# Altium project Pathfinder.PrjPcb
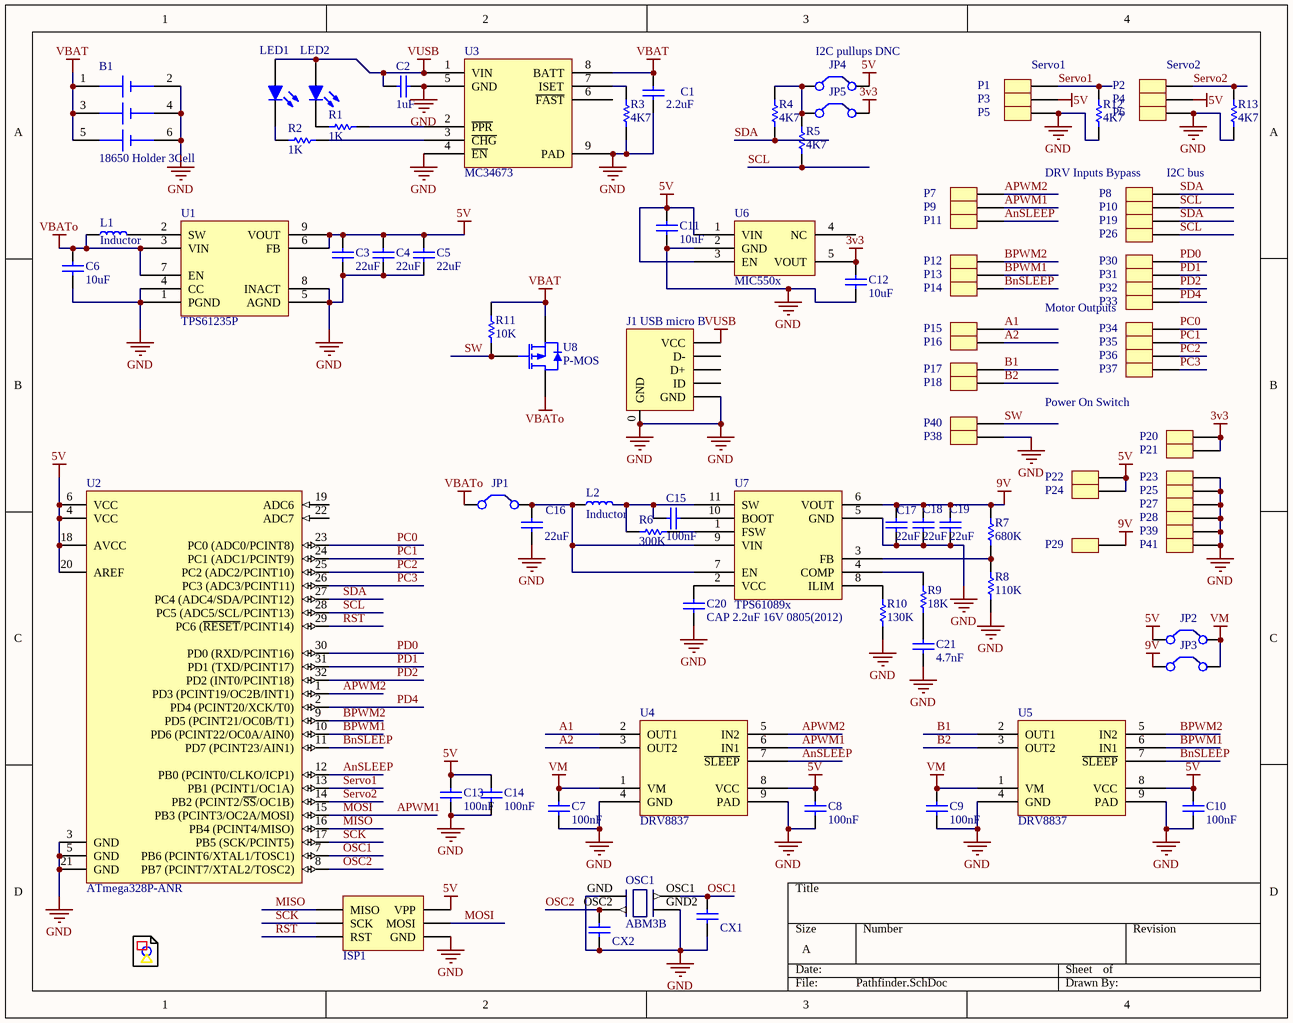
[diagram p0: Pathfinder.SchDoc]
1 sheet, 99 parts. Net scope: global (net labels, ports and power ports of the same name join across sheets).
Board file: Pathfinder.PcbDoc

## Sheet Pathfinder.SchDoc
size A

### Parts
*  Logo  [Zap Cloud]  (value not drawn)
B1  18650 Holder 3Cell  [18650-3Cell]
C1  2.2uF  [CAPC0805(2012)100_L]
C2  1uF  [CAPC0805(2012)100_L]
C3  22uF  [CAPC0805(2012)100_L]
C4  22uF  [CAPC0805(2012)100_L]
C5  22uF  [CAPC0805(2012)100_L]
C6  10uF  [CAPC0805(2012)145_M]
C7  100nF  [CAPC0805(2012)100_M]
C8  100nF  [CAPC0805(2012)100_M]
C9  100nF  [CAPC0805(2012)100_M]
C10  100nF  [CAPC0805(2012)100_M]
C11  10uF  [CAPC0805(2012)145_M]
C12  10uF  [CAPC0805(2012)145_M]
C13  100nF  [CAPC0805(2012)100_M]
C14  100nF  [CAPC0805(2012)100_M]
C15  100nF  [CAPC0805(2012)100_M]
C16  22uF  [CAPC0805(2012)100_L]
C17  22uF  [CAPC0805(2012)100_L]
C18  22uF  [CAPC0805(2012)100_L]
C19  22uF  [CAPC0805(2012)100_L]
C20  CAP 2.2uF 16V 0805(2012)  [CAPC0805(2012)145_L]
C21  4.7nF  [CAPC0805(2012)145_N]
CX1  CAP 22pF 10V 0603(1608)  [CAPC0603(1608)100_M]  (value not drawn)
CX2  CAP 22pF 10V 0603(1608)  [CAPC0603(1608)100_M]  (value not drawn)
ISP1  AVRISP  [2x3 100mil Header]  (value not drawn)
J1  USB micro B  [USB Micro SMD]
JP1  SolderJumper  [bridge]  (value not drawn)
JP2  SolderJumper  [bridge]  (value not drawn)
JP3  SolderJumper  [bridge]  (value not drawn)
JP4  SolderJumper  [bridge]  (value not drawn)
JP5  SolderJumper  [bridge]  (value not drawn)
L1  Inductor  [XAL7030-102ME]
L2  Inductor  [CDMC8D28NP-1R8MC]
LED1  LED2  [LED0805]  (value not drawn)
LED2  LED2  [LED0805]  (value not drawn)
OSC1  ABM3B  [ABM3B]
P1  SV1  [Pin 100mil]  (value not drawn)
P2  SV2  [Pin 100mil]  (value not drawn)
P3  5V  [Pin 100mil]  (value not drawn)
P4  5V  [Pin 100mil]  (value not drawn)
P5  GND  [Pin 100mil]  (value not drawn)
P6  GND  [Pin 100mil]  (value not drawn)
P7  Ain2  [Pin 100mil]  (value not drawn)
P8  SDA  [Pin 100mil]  (value not drawn)
P9  Ain1  [Pin 100mil]  (value not drawn)
P10  SCL  [Pin 100mil]  (value not drawn)
P11  ASLP  [Pin 100mil]  (value not drawn)
P12  Bin2  [Pin 100mil]  (value not drawn)
P13  Bin1  [Pin 100mil]  (value not drawn)
P14  BSLP  [Pin 100mil]  (value not drawn)
P15  AO1  [Pin 100mil]  (value not drawn)
P16  AO2  [Pin 100mil]  (value not drawn)
P17  BO1  [Pin 100mil]  (value not drawn)
P18  BO2  [Pin 100mil]  (value not drawn)
P19  SDA  [Pin 100mil]  (value not drawn)
P20  3v3  [Pin 100mil]  (value not drawn)
P21  3v3  [Pin 100mil]  (value not drawn)
P22  5V  [Pin 100mil]  (value not drawn)
P23  GND  [Pin 100mil]  (value not drawn)
P24  5V  [Pin 100mil]  (value not drawn)
P25  GND  [Pin 100mil]  (value not drawn)
P26  SCL  [Pin 100mil]  (value not drawn)
P27  GND  [Pin 100mil]  (value not drawn)
P28  GND  [Pin 100mil]  (value not drawn)
P29  9V  [Pin 100mil]  (value not drawn)
P30  PD0  [Pin 100mil]  (value not drawn)
P31  PD1  [Pin 100mil]  (value not drawn)
P32  PD2  [Pin 100mil]  (value not drawn)
P33  PD4  [Pin 100mil]  (value not drawn)
P34  PC0  [Pin 100mil]  (value not drawn)
P35  PC1  [Pin 100mil]  (value not drawn)
P36  PC2  [Pin 100mil]  (value not drawn)
P37  PC3  [Pin 100mil]  (value not drawn)
P38  SDA  [Pin 100mil]  (value not drawn)
P39  GND  [Pin 100mil]  (value not drawn)
P40  SDA  [Pin 100mil]  (value not drawn)
P41  GND  [Pin 100mil]  (value not drawn)
R1  1K  [RESC0805(2012)_N]
R2  1K  [RESC0805(2012)_N]
R3  4K7  [RESC0805(2012)_N]
R4  4K7  [RESC0805(2012)_N]
R5  4K7  [RESC0805(2012)_N]
R6  300K  [RESC0805(2012)_M]
R7  680K  [RESC0805(2012)_M]
R8  110K  [RESC0805(2012)_M]
R9  18K  [RESC0805(2012)_M]
R10  130K  [RESC0805(2012)_N]
R11  10K  [RESC0603(1608)_N]
R12  4K7  [RESC0805(2012)_N]
R13  4K7  [RESC0805(2012)_N]
U1  TPS61235P  [VQFN-HR-TPS61235PRWLR]
U2  ATmega328P-ANR  [32A_M]
U3  MC34673  [UDFN-8 2 x 3 x 0.65]
U4  DRV8837  [WSON-8]
U5  DRV8837  [WSON-8]
U6  MIC550x  [SOT-23-5]
U7  TPS61089x  [VQFN-11 2 x 2.5]
U8  P-MOS  [SOIC-8-MOSFET]

### Nets
3v3: C12.2 JP5.2(C2) P20.0 P21.0 U6.5(VOUT)
5V: C3.2 C4.2 C5.2 C8.2 C10.2 C11.2 C13.2 C14.2 ISP1.2(VPP) JP2.1(C1) JP4.2(C2) P3.0 P4.0 P22.0 P24.0 U1.6(FB) U1.9(VOUT) U2.4(VCC) U2.6(VCC) U2.18(AVCC) U2.20(AREF) U4.8(VCC) U5.8(VCC) U6.1(VIN) U6.3(EN)
9V: C17.2 C18.2 C19.2 JP3.1(C1) P29.0 R7.2 U7.6(VOUT)
GND: B1.2 B1.4 B1.6 C1.1 C2.1 C3.1 C4.1 C5.1 C6.1 C7.1 C8.1 C9.1 C10.1 C11.1 C12.1 C13.1 C14.1 C16.1 C17.1 C18.1 C19.1 C20.1 C21.1 CX1.1 CX2.1 ISP1.6(GND) J1.0(GND) J1.5(GND) OSC1.GND OSC1.GND2(GND) P5.0 P6.0 P23.0 P25.0 P27.0 P28.0 P38.0 P39.0 P41.0 R3.1 R8.1 R10.1 R12.1 R13.1 U1.1(PGND) U1.4(CC) U1.5(AGND) U1.8(INACT) U2.3(GND) U2.5(GND) U2.21(GND) U3.4(~{EN}) U3.5(GND) U3.9(PAD) U4.4(GND) U4.9(PAD) U5.4(GND) U5.9(PAD) U6.2(GND) U7.5(GND)
VBAT: B1.1 B1.3 B1.5 C1.2 R11.2 U3.8(BATT) U8.1(S)
VBATo: C6.2 JP1.1(C1) L1.1 U1.3(VIN) U1.7(EN) U8.3(D)
VM: C7.2 C9.2 JP2.2(C2) JP3.2(C2) U4.1(VM) U5.1(VM)
VUSB: C2.2 J1.1(VCC) LED1.1(A) LED2.1(A) U3.1(VIN)
A1: P15.0 U4.2(OUT1)
A2: P16.0 U4.3(OUT2)
AnSLEEP: P11.0 U2.12(PB0_(PCINT0/CLKO/ICP1)) U4.7(~{SLEEP})
APWM1: ISP1.4(MOSI) P9.0 U2.15(PB3_(PCINT3/OC2A/MOSI)) U4.6(IN1)  [also labelled MOSI]
APWM2: P7.0 U2.1(PD3_(PCINT19/OC2B/INT1)) U4.5(IN2)
B1: P17.0 U5.2(OUT1)
B2: P18.0 U5.3(OUT2)
BnSLEEP: P14.0 U2.11(PD7_(PCINT23/AIN1)) U5.7(~{SLEEP})
BPWM1: P13.0 U2.10(PD6_(PCINT22/OC0A/AIN0)) U5.6(IN1)
BPWM2: P12.0 U2.9(PD5_(PCINT21/OC0B/T1)) U5.5(IN2)
MISO: ISP1.1(MISO) U2.16(PB4_(PCINT4/MISO))
OSC1: CX1.2 OSC1.OSC1 U2.7(PB6_(PCINT6/XTAL1/TOSC1))
OSC2: CX2.2 OSC1.OSC2 U2.8(PB7_(PCINT7/XTAL2/TOSC2))
PC0: P34.0 U2.23(PC0_(ADC0/PCINT8))
PC1: P35.0 U2.24(PC1_(ADC1/PCINT9))
PC2: P36.0 U2.25(PC2_(ADC2/PCINT10))
PC3: P37.0 U2.26(PC3_(ADC3/PCINT11))
PD0: P30.0 U2.30(PD0_(RXD/PCINT16))
PD1: P31.0 U2.31(PD1_(TXD/PCINT17))
PD2: P32.0 U2.32(PD2_(INT0/PCINT18))
PD4: P33.0 U2.2(PD4_(PCINT20/XCK/T0))
RST: ISP1.5(RST) U2.29(PC6_(~{RESET}/PCINT14))
SCK: ISP1.3(SCK) U2.17(PB5_(SCK/PCINT5))
SCL: P10.0 P26.0 R5.1 U2.28(PC5_(ADC5/SCL/PCINT13))
SDA: P8.0 P19.0 R4.1 U2.27(PC4_(ADC4/SDA/PCINT12))
Servo1: P1.0 R12.2 U2.13(PB1_(PCINT1/OC1A))
Servo2: P2.0 R13.2 U2.14(PB2_(PCINT2/~{SS}/OC1B))
SW: P40.0 R11.1 U8.2(G)
NetC15_1: C15.1 U7.10(BOOT)
NetC15_2: C15.2 L2.2 R6.2 U7.11(SW)
NetC16_2: C16.2 JP1.2(C2) L2.1 U7.7(EN) U7.9(VIN)
NetC20_2: C20.2 U7.2(VCC)
NetC21_2: C21.2 R9.1
NetJP4_1: JP4.1(C1) JP5.1(C1) R4.2 R5.2
NetL1_2: L1.2 U1.2(SW)
NetLED1_2: LED1.2(K) R2.2
NetLED2_2: LED2.2(K) R1.2
NetR1_1: R1.1 U3.2(~{PPR})
NetR2_1: R2.1 U3.3(~{CHG})
NetR3_2: R3.2 U3.7(ISET)
NetR6_1: R6.1 U7.1(FSW)
NetR7_1: R7.1 R8.2 U7.3(FB)
NetR9_2: R9.2 U7.4(COMP)
NetR10_2: R10.2 U7.8(ILIM)

Not connected (* = marked no-connect by the designer): J1 2(D-) 3(D+) 4(ID); U2 19(ADC6) 22(ADC7); U3 6(~{FAST}); U6 4(NC)

### Notes on the sheet
- I2C pullups DNC
- (near P1) Servo1
- (near P2) Servo2
- (near P7) DRV Inputs Bypass
- (near P8) I2C bus
- Motor Outputs
- Power On Switch

### Library data of the parts
B1 = BK18650-3Cell: BK-18650-PC6
C1 = CMP-1036-04832-1: CAP 2.2uF 16V ±10% 0805 (2012 Metric) Thickness 1mm SMD; Tolerance: Â±10%; Case-Metric: 2012; Case-EIA: 0805; Rated Voltage: 16 V; Value: 2.2uF; Technology: SMT; Max Thickness: 1 mm
C2 = CMP-1036-04749-1: CAP 1uF 16V ±20% 0805 (2012 Metric) Thickness 1mm SMD; Case-EIA: 0805; Case-Metric: 2012; Tolerance: Â±20%; Value: 1uF; Rated Voltage: 16 V; Max Thickness: 1 mm; Technology: SMT
C3-C5 C16-C19 = CMP-1036-04944-1: CAP 22uF 10V ±20% 0805 (2012 Metric) Thickness 1mm SMD; Case-Metric: 2012; Case-EIA: 0805; Tolerance: Â±20%; Technology: SMT; Max Thickness: 1 mm; Value: 22uF; Rated Voltage: 10 V
C6 C11 C12 = CMP-1036-04926-1: CAP 10uF 10V -20% to +80% 0805 (2012 Metric) Thickness 1.45mm SMD; Case-EIA: 0805; Case-Metric: 2012; Technology: SMT; Max Thickness: 1.45 mm; Rated Voltage: 10 V; Value: 10uF; Tolerance: -20% to +80%
C7-C10 C13-C15 = CMP-1036-04394-1: CAP 100nF 10V ±10% 0805 (2012 Metric) Thickness 1mm SMD; Case-EIA: 0805; Tolerance: Â±10%; Case-Metric: 2012; Max Thickness: 1 mm; Technology: SMT; Value: 100nF; Rated Voltage: 10 V
C20 = CMP-1036-04831-1: CAP 2.2uF 16V ±10% 0805 (2012 Metric) Thickness 1.45mm SMD; Case-Metric: 2012; Tolerance: Â±10%; Case-EIA: 0805; Value: 2.2uF; Max Thickness: 1.45 mm; Technology: SMT; Rated Voltage: 16 V
C21 = CMP-1036-03558-1: CAP 4.7nF 16V ±1% 0805 (2012 Metric) Thickness 1.45mm SMD; Tolerance: Â±1%; Case-Metric: 2012; Case-EIA: 0805; Rated Voltage: 16 V; Max Thickness: 1.45 mm; Value: 4.7nF; Technology: SMT
CX1 CX2 = CMP-1035-00798-1: CAP 22pF 10V ±0.5pF 0603 (1608 Metric) Thickness 1mm SMD; Case-Metric: 1608; Case-EIA: 0603; Technology: SMT; Tolerance: ±0.5pF; Value: 22pF; Max Thickness: 1 mm; Rated Voltage: 10 V
ISP1 = AVRISP: AVR ISP connection
J1 = Micro-USB: Micro USB connector
JP1-JP5 = SolderJumper: Solder Configuration Jumper; Published: 24-Mar-1999; LatestRevisionDate: 17-Jul-2002; LatestRevisionNote: Re-released for DXP Platform.; PackageReference: RAD-0.2; Publisher: Altium Limited; PackageDescription: Radial Cap, Thru-Hole; 2 Leads; 0.2 in Pin Spacing
L1 L2 = Inductor: Generic Inductor
LED1 LED2 = LED2: Typical RED, GREEN, YELLOW, AMBER GaAs LED; Published: 8-Jun-2000; LatestRevisionDate: 17-Jul-2002; LatestRevisionNote: Re-released for DXP Platform.; PackageVersion: Feb-2002; PackageReference: 3.2X1.6X1.1; Publisher: Altium Limited; PackageDescription: SM LED; 2 Flat Leads
OSC1 = ABM3B: pin to pad: GND2>GND
P1-P41 = 1-Pin
R1 R2 = CMP-1013-00074-1: 1K 0.125W 5% 0805 (2012 Metric)  SMD; Case-EIA: 0805; Case-Metric: 2012; Value: 1000.00 Ohm; Technology: SMT; Power: 0.125 W; Tolerance: 5 %
R3-R5 R12 R13 = CMP-1013-00090-1: 4K7 0.125W 5% 0805 (2012 Metric)  SMD; Case-EIA: 0805; Value: 4700.00 Ohm; Case-Metric: 2012; Power: 0.125 W; Tolerance: 5 %; Technology: SMT
R6 = CMP-1013-00133-1: 300K 0.125W 5% 0805 (2012 Metric)  SMD; Value: 300000.00 Ohm; Case-EIA: 0805; Case-Metric: 2012; Tolerance: 5 %; Technology: SMT; Power: 0.125 W
R7 = CMP-1013-00142-1: 680K 0.125W 5% 0805 (2012 Metric)  SMD; Case-EIA: 0805; Value: 680000.00 Ohm; Case-Metric: 2012; Power: 0.125 W; Technology: SMT; Tolerance: 5 %
R8 = CMP-1013-00123-1: 110K 0.125W 5% 0805 (2012 Metric)  SMD; Case-EIA: 0805; Case-Metric: 2012; Value: 110000.00 Ohm; Technology: SMT; Tolerance: 5 %; Power: 0.125 W
R9 = CMP-1013-00104-1: 18K 0.125W 5% 0805 (2012 Metric)  SMD; Value: 18000.00 Ohm; Case-EIA: 0805; Case-Metric: 2012; Technology: SMT; Power: 0.125 W; Tolerance: 5 %
R10 = CMP-1013-00125-1: 130K 0.125W 5% 0805 (2012 Metric)  SMD; Value: 130000.00 Ohm; Case-EIA: 0805; Case-Metric: 2012; Technology: SMT; Tolerance: 5 %; Power: 0.125 W
R11 = CMP-1012-00098-1: 10K 0.1W 5% 0603 (1608 Metric)  SMD; Case-EIA: 0603; Value: 10000.00 Ohm; Case-Metric: 1608; Technology: SMT; Tolerance: 5 %; Power: 0.1 W
U1 = TPS61235P: 8-A Valley Current Synchronous Boost Converter
U2 = CMP-0095-00621-1: 8-bit AVR Microcontroller, 32KB Flash, 1KB EEPROM, 2KB SRAM, 32-pin TQFP, Industrial Grade (-40°C to 105°C), Reel; PackageDescription: 32-Lead, 7x7x1.0 mm Body, 0.8mm Lead Pitch, Thin Profile Plastic Quad Flat Package (TQFP); ComponentLink3URL: http://www.atmel.com/dyn/resources/prod_documents/8271S.pdf; ComponentLink1Description: Manufacturer URL; PackageReference: 32A; PackageVersion: revC, Oct-2010; ComponentLink1URL: http://www.atmel.com/; ComponentLink2URL: http://www.atmel.com/dyn/resources/prod_documents/8271.pdf; ComponentLink2Description: ATmega48A/48PA/88A/88PA/168A/168PA/328/328P Datasheet; ComponentLink3Description: ATmega48A/48PA/88A/88PA/168A/168PA/328/328P Summary; Code_JEDEC: MS-026-ABA; DatasheetVersion: revD, May-2011
U3 = MC34673: 1.2A Charger  for Single-cell Li-Ion Batteries
U4 U5 = DRV8837: Low-Voltage H-Bridge Driver
U6 = MIC550x: MIC550x Regulator
U7 = TPS61089x: 12.6-V, 7-A Fully-Integrated Synchronous Boost Converter
U8 = SI4403CDY-T1: pin to pad: 1>S 2>G 3>D